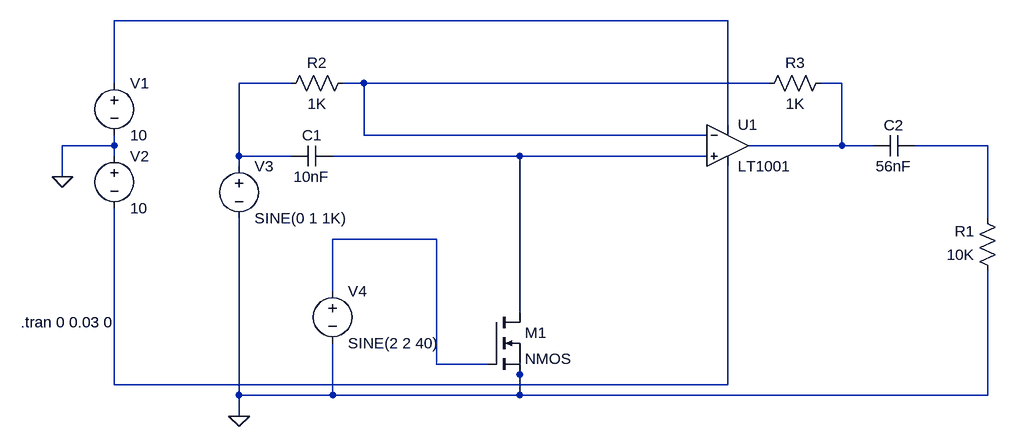
[diagram p0: schematic phase_shift_fet_opamp.asc]
phase_shift_fet_opamp.asc, the LTspice schematic file:
Version 4
SHEET 1 1300 680
WIRE 880 -80 -64 -80
WIRE -64 16 -64 -80
WIRE 208 16 128 16
WIRE 320 16 288 16
WIRE 944 16 320 16
WIRE 1056 16 1024 16
WIRE 880 80 880 -80
WIRE 320 96 320 16
WIRE 848 96 320 96
WIRE -64 112 -64 96
WIRE -64 112 -144 112
WIRE 1056 112 1056 16
WIRE 1056 112 912 112
WIRE 1104 112 1056 112
WIRE 1280 112 1168 112
WIRE -64 128 -64 112
WIRE 128 128 128 16
WIRE 208 128 128 128
WIRE 560 128 272 128
WIRE 848 128 560 128
WIRE 128 144 128 128
WIRE -144 160 -144 112
WIRE 1280 224 1280 112
WIRE 432 256 272 256
WIRE 272 336 272 256
WIRE 560 368 560 128
WIRE 432 448 432 256
WIRE 512 448 432 448
WIRE 560 464 560 448
WIRE -64 480 -64 208
WIRE 880 480 880 144
WIRE 880 480 -64 480
WIRE 128 496 128 224
WIRE 272 496 272 416
WIRE 272 496 128 496
WIRE 560 496 560 464
WIRE 560 496 272 496
WIRE 1280 496 1280 304
WIRE 1280 496 560 496
WIRE 128 528 128 496
FLAG -144 160 0
FLAG 128 528 0
SYMBOL Opamps\\LT1001 880 48 R0
SYMATTR InstName U1
SYMBOL voltage -64 0 R0
WINDOW 123 0 0 Left 2
WINDOW 39 0 0 Left 2
SYMATTR InstName V1
SYMATTR Value 10
SYMBOL voltage -64 112 R0
WINDOW 123 0 0 Left 2
WINDOW 39 0 0 Left 2
SYMATTR InstName V2
SYMATTR Value 10
SYMBOL cap 272 112 R90
WINDOW 0 0 32 VBottom 2
WINDOW 3 32 32 VTop 2
SYMATTR InstName C1
SYMATTR Value 10nF
SYMBOL res 304 0 R90
WINDOW 0 0 56 VBottom 2
WINDOW 3 32 56 VTop 2
SYMATTR InstName R2
SYMATTR Value 1K
SYMBOL res 1040 0 R90
WINDOW 0 0 56 VBottom 2
WINDOW 3 32 56 VTop 2
SYMATTR InstName R3
SYMATTR Value 1K
SYMBOL voltage 128 128 R0
WINDOW 123 0 0 Left 2
WINDOW 39 0 0 Left 2
SYMATTR InstName V3
SYMATTR Value SINE(0 1 1K)
SYMBOL voltage 272 320 R0
WINDOW 123 0 0 Left 2
WINDOW 39 0 0 Left 2
SYMATTR InstName V4
SYMATTR Value SINE(2 2 40)
SYMBOL nmos 512 368 R0
SYMATTR InstName M1
SYMBOL cap 1168 96 R90
WINDOW 0 0 32 VBottom 2
WINDOW 3 32 32 VTop 2
SYMATTR InstName C2
SYMATTR Value 56nF
SYMBOL res 1296 320 R180
WINDOW 0 36 76 Left 2
WINDOW 3 36 40 Left 2
SYMATTR InstName R1
SYMATTR Value 10K
TEXT -208 384 Left 2 !.tran 0 0.03 0

The netlist it stands for:
* phase_shift_fet_opamp.asc
XU1 N006 N003 N001 N008 N004 LT1001  ; pins In+ In- V+ V- OUT
V1 N001 0 10
V2 0 N008 10
C1 N006 N002 10nF
R2 N003 N002 1K
R3 N004 N003 1K
V3 N002 0 SINE(0 1 1K)
V4 N007 0 SINE(2 2 40)
M1 N006 N007 0 0 NMOS
C2 N005 N004 56nF
R1 0 N005 10K
.model NMOS NMOS
.model PMOS PMOS
.lib standard.mos
.tran 0 0.03 0
.lib LTC.lib
.backanno
.end